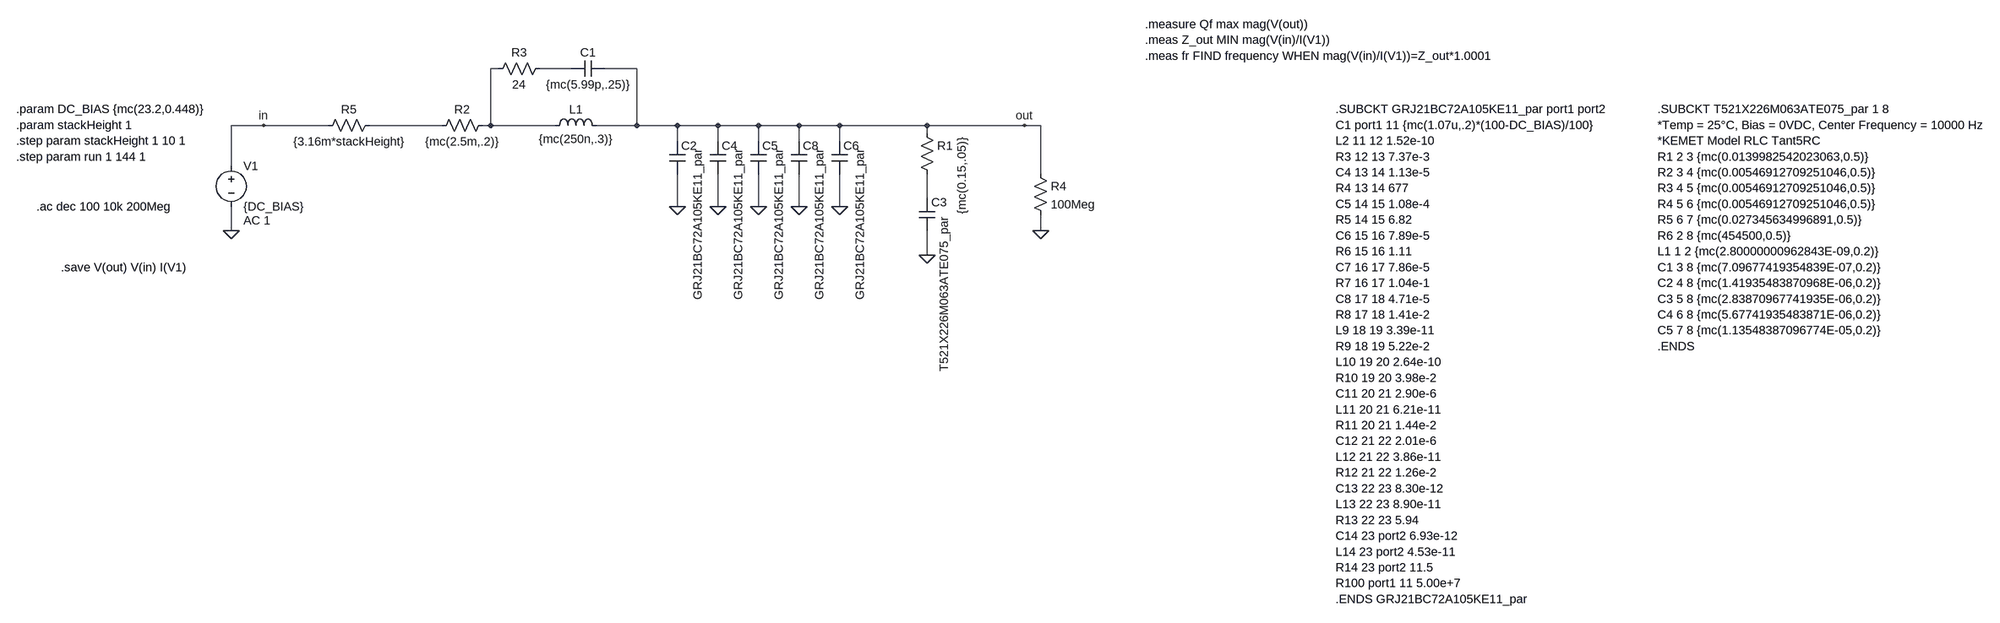
[diagram p0: schematic +12V Input Filter.asc]
+12V Input Filter.asc, the LTspice schematic file:
Version 4
SHEET 1 3336 996
WIRE 64 32 48 32
WIRE 208 32 144 32
WIRE 336 32 272 32
WIRE -400 144 -464 144
WIRE -272 144 -400 144
WIRE -48 144 -192 144
WIRE 48 144 48 32
WIRE 48 144 32 144
WIRE 176 144 48 144
WIRE 336 144 336 32
WIRE 336 144 256 144
WIRE 416 144 336 144
WIRE 496 144 416 144
WIRE 576 144 496 144
WIRE 656 144 576 144
WIRE 736 144 656 144
WIRE 912 144 736 144
WIRE 1104 144 912 144
WIRE 1136 144 1104 144
WIRE 912 160 912 144
WIRE 416 176 416 144
WIRE 496 176 496 144
WIRE 576 176 576 144
WIRE 656 176 656 144
WIRE 736 176 736 144
WIRE -464 224 -464 144
WIRE 1136 240 1136 144
WIRE 912 288 912 240
WIRE 416 304 416 240
WIRE 496 304 496 240
WIRE 576 304 576 240
WIRE 656 304 656 240
WIRE 736 304 736 240
WIRE -464 352 -464 304
WIRE 1136 352 1136 320
WIRE 912 400 912 352
FLAG -464 352 0
FLAG 912 400 0
FLAG -400 144 in
FLAG 496 304 0
FLAG 576 304 0
FLAG 1136 352 0
FLAG 416 304 0
FLAG 1104 144 out
FLAG 736 304 0
FLAG 656 304 0
SYMBOL ind 160 160 R270
WINDOW 0 32 56 VTop 2
WINDOW 3 5 56 VBottom 2
WINDOW 39 -23 56 VBottom 2
SYMATTR InstName L1
SYMATTR Value {mc(250n,.3)}
SYMBOL voltage -464 208 R0
WINDOW 123 24 124 Left 2
WINDOW 39 0 0 Left 0
SYMATTR Value2 AC 1
SYMATTR InstName V1
SYMATTR Value {DC_BIAS}
SYMBOL res 48 128 R90
WINDOW 0 0 56 VBottom 2
WINDOW 3 32 56 VTop 2
SYMATTR InstName R2
SYMATTR Value {mc(2.5m,.2)}
SYMBOL res 160 16 R90
WINDOW 0 0 56 VBottom 2
WINDOW 3 32 56 VTop 2
SYMATTR InstName R3
SYMATTR Value 24
SYMBOL cap 272 16 R90
WINDOW 0 0 32 VBottom 2
WINDOW 3 32 32 VTop 2
SYMATTR InstName C1
SYMATTR Value {mc(5.99p,.25)}
SYMBOL cap 896 288 R0
WINDOW 3 50 35 VRight 2
SYMATTR Value T521X226M063ATE075_par
SYMATTR InstName C3
SYMATTR Prefix X
SYMBOL res 896 144 R0
WINDOW 3 85 23 VRight 2
SYMATTR Value {mc(0.15,.05)}
SYMATTR InstName R1
SYMBOL cap 480 176 R0
WINDOW 3 57 313 VLeft 2
SYMATTR Value GRJ21BC72A105KE11_par
SYMATTR InstName C4
SYMATTR Prefix X
SYMBOL cap 560 176 R0
WINDOW 3 57 313 VLeft 2
SYMATTR Value GRJ21BC72A105KE11_par
SYMATTR InstName C5
SYMATTR Prefix X
SYMBOL res -176 128 R90
WINDOW 0 0 56 VBottom 2
WINDOW 3 32 56 VTop 2
SYMATTR InstName R5
SYMATTR Value {3.16m*stackHeight}
SYMBOL res 1120 224 R0
SYMATTR InstName R4
SYMATTR Value 100Meg
SYMBOL cap 400 176 R0
WINDOW 3 57 313 VLeft 2
SYMATTR Value GRJ21BC72A105KE11_par
SYMATTR InstName C2
SYMATTR Prefix X
SYMBOL cap 720 176 R0
WINDOW 3 57 313 VLeft 2
SYMATTR Value GRJ21BC72A105KE11_par
SYMATTR InstName C6
SYMATTR Prefix X
SYMBOL cap 640 176 R0
WINDOW 3 57 313 VLeft 2
SYMATTR Value GRJ21BC72A105KE11_par
SYMATTR InstName C8
SYMATTR Prefix X
TEXT -848 304 Left 2 !.ac dec 100 10k 200Meg
TEXT -888 112 Left 2 !.param DC_BIAS {mc(23.2,0.448)}\n.param stackHeight 1\n.step param stackHeight 1 10 1\n.step param run 1 144 1
TEXT 1976 112 Left 2 !.SUBCKT GRJ21BC72A105KE11_par port1 port2\nC1 port1 11 {mc(1.07u,.2)*(100-DC_BIAS)/100}\nL2 11 12 1.52e-10\nR3 12 13 7.37e-3\nC4 13 14 1.13e-5\nR4 13 14 677\nC5 14 15 1.08e-4\nR5 14 15 6.82\nC6 15 16 7.89e-5\nR6 15 16 1.11\nC7 16 17 7.86e-5\nR7 16 17 1.04e-1\nC8 17 18 4.71e-5\nR8 17 18 1.41e-2\nL9 18 19 3.39e-11\nR9 18 19 5.22e-2\nL10 19 20 2.64e-10\nR10 19 20 3.98e-2\nC11 20 21 2.90e-6\nL11 20 21 6.21e-11\nR11 20 21 1.44e-2\nC12 21 22 2.01e-6\nL12 21 22 3.86e-11\nR12 21 22 1.26e-2\nC13 22 23 8.30e-12\nL13 22 23 8.90e-11\nR13 22 23 5.94\nC14 23 port2 6.93e-12\nL14 23 port2 4.53e-11\nR14 23 port2 11.5\nR100 port1 11 5.00e+7\n.ENDS GRJ21BC72A105KE11_par
TEXT 2648 112 Left 2 !.SUBCKT T521X226M063ATE075_par 1 8\n*Temp = 25°C, Bias = 0VDC, Center Frequency = 10000 Hz\n*KEMET Model RLC Tant5RC\nR1 2 3 {mc(0.0139982542023063,0.5)}\nR2 3 4 {mc(0.00546912709251046,0.5)}\nR3 4 5 {mc(0.00546912709251046,0.5)}\nR4 5 6 {mc(0.00546912709251046,0.5)}\nR5 6 7 {mc(0.027345634996891,0.5)}\nR6 2 8 {mc(454500,0.5)}\nL1 1 2 {mc(2.80000000962843E-09,0.2)}\nC1 3 8 {mc(7.09677419354839E-07,0.2)}\nC2 4 8 {mc(1.41935483870968E-06,0.2)}\nC3 5 8 {mc(2.83870967741935E-06,0.2)}\nC4 6 8 {mc(5.67741935483871E-06,0.2)}\nC5 7 8 {mc(1.13548387096774E-05,0.2)}\n.ENDS
TEXT 1600 -56 Left 2 !.measure Qf max mag(V(out))\n.meas Z_out MIN mag(V(in)/I(V1))\n.meas fr FIND frequency WHEN mag(V(in)/I(V1))=Z_out*1.0001
TEXT -800 424 Left 2 !.save V(out) V(in) I(V1)

The netlist it stands for:
* +12V Input Filter.asc
L1 N001 out {mc(250n,.3)}
V1 in 0 {DC_BIAS} AC 1
R2 N001 N003 {mc(2.5m,.2)}
R3 N002 N001 24
C1 out N002 {mc(5.99p,.25)}
XC3 N004 0 T521X226M063ATE075_par  ; pins A B
R1 out N004 {mc(0.15,.05)}
XC4 out 0 GRJ21BC72A105KE11_par  ; pins A B
XC5 out 0 GRJ21BC72A105KE11_par  ; pins A B
R5 N003 in {3.16m*stackHeight}
R4 out 0 100Meg
XC2 out 0 GRJ21BC72A105KE11_par  ; pins A B
XC6 out 0 GRJ21BC72A105KE11_par  ; pins A B
XC8 out 0 GRJ21BC72A105KE11_par  ; pins A B
.ac dec 100 10k 200Meg
.param DC_BIAS {mc(23.2,0.448)}
.param stackHeight 1
.step param stackHeight 1 10 1
.step param run 1 144 1
.SUBCKT GRJ21BC72A105KE11_par port1 port2
C1 port1 11 {mc(1.07u,.2)*(100-DC_BIAS)/100}
L2 11 12 1.52e-10
R3 12 13 7.37e-3
C4 13 14 1.13e-5
R4 13 14 677
C5 14 15 1.08e-4
R5 14 15 6.82
C6 15 16 7.89e-5
R6 15 16 1.11
C7 16 17 7.86e-5
R7 16 17 1.04e-1
C8 17 18 4.71e-5
R8 17 18 1.41e-2
L9 18 19 3.39e-11
R9 18 19 5.22e-2
L10 19 20 2.64e-10
R10 19 20 3.98e-2
C11 20 21 2.90e-6
L11 20 21 6.21e-11
R11 20 21 1.44e-2
C12 21 22 2.01e-6
L12 21 22 3.86e-11
R12 21 22 1.26e-2
C13 22 23 8.30e-12
L13 22 23 8.90e-11
R13 22 23 5.94
C14 23 port2 6.93e-12
L14 23 port2 4.53e-11
R14 23 port2 11.5
R100 port1 11 5.00e+7
.ENDS GRJ21BC72A105KE11_par
.SUBCKT T521X226M063ATE075_par 1 8
*Temp = 25°C, Bias = 0VDC, Center Frequency = 10000 Hz
*KEMET Model RLC Tant5RC
R1 2 3 {mc(0.0139982542023063,0.5)}
R2 3 4 {mc(0.00546912709251046,0.5)}
R3 4 5 {mc(0.00546912709251046,0.5)}
R4 5 6 {mc(0.00546912709251046,0.5)}
R5 6 7 {mc(0.027345634996891,0.5)}
R6 2 8 {mc(454500,0.5)}
L1 1 2 {mc(2.80000000962843E-09,0.2)}
C1 3 8 {mc(7.09677419354839E-07,0.2)}
C2 4 8 {mc(1.41935483870968E-06,0.2)}
C3 5 8 {mc(2.83870967741935E-06,0.2)}
C4 6 8 {mc(5.67741935483871E-06,0.2)}
C5 7 8 {mc(1.13548387096774E-05,0.2)}
.ENDS
.measure Qf max mag(V(out))
.meas Z_out MIN mag(V(in)/I(V1))
.meas fr FIND frequency WHEN mag(V(in)/I(V1))=Z_out*1.0001
.save V(out) V(in) I(V1)
.backanno
.end